# Altium schematic sheet OK1050-C_V1.2_Usb.SchDoc
size A3; Revision: 1.2; SheetNumber: 2; SheetTotal: 7
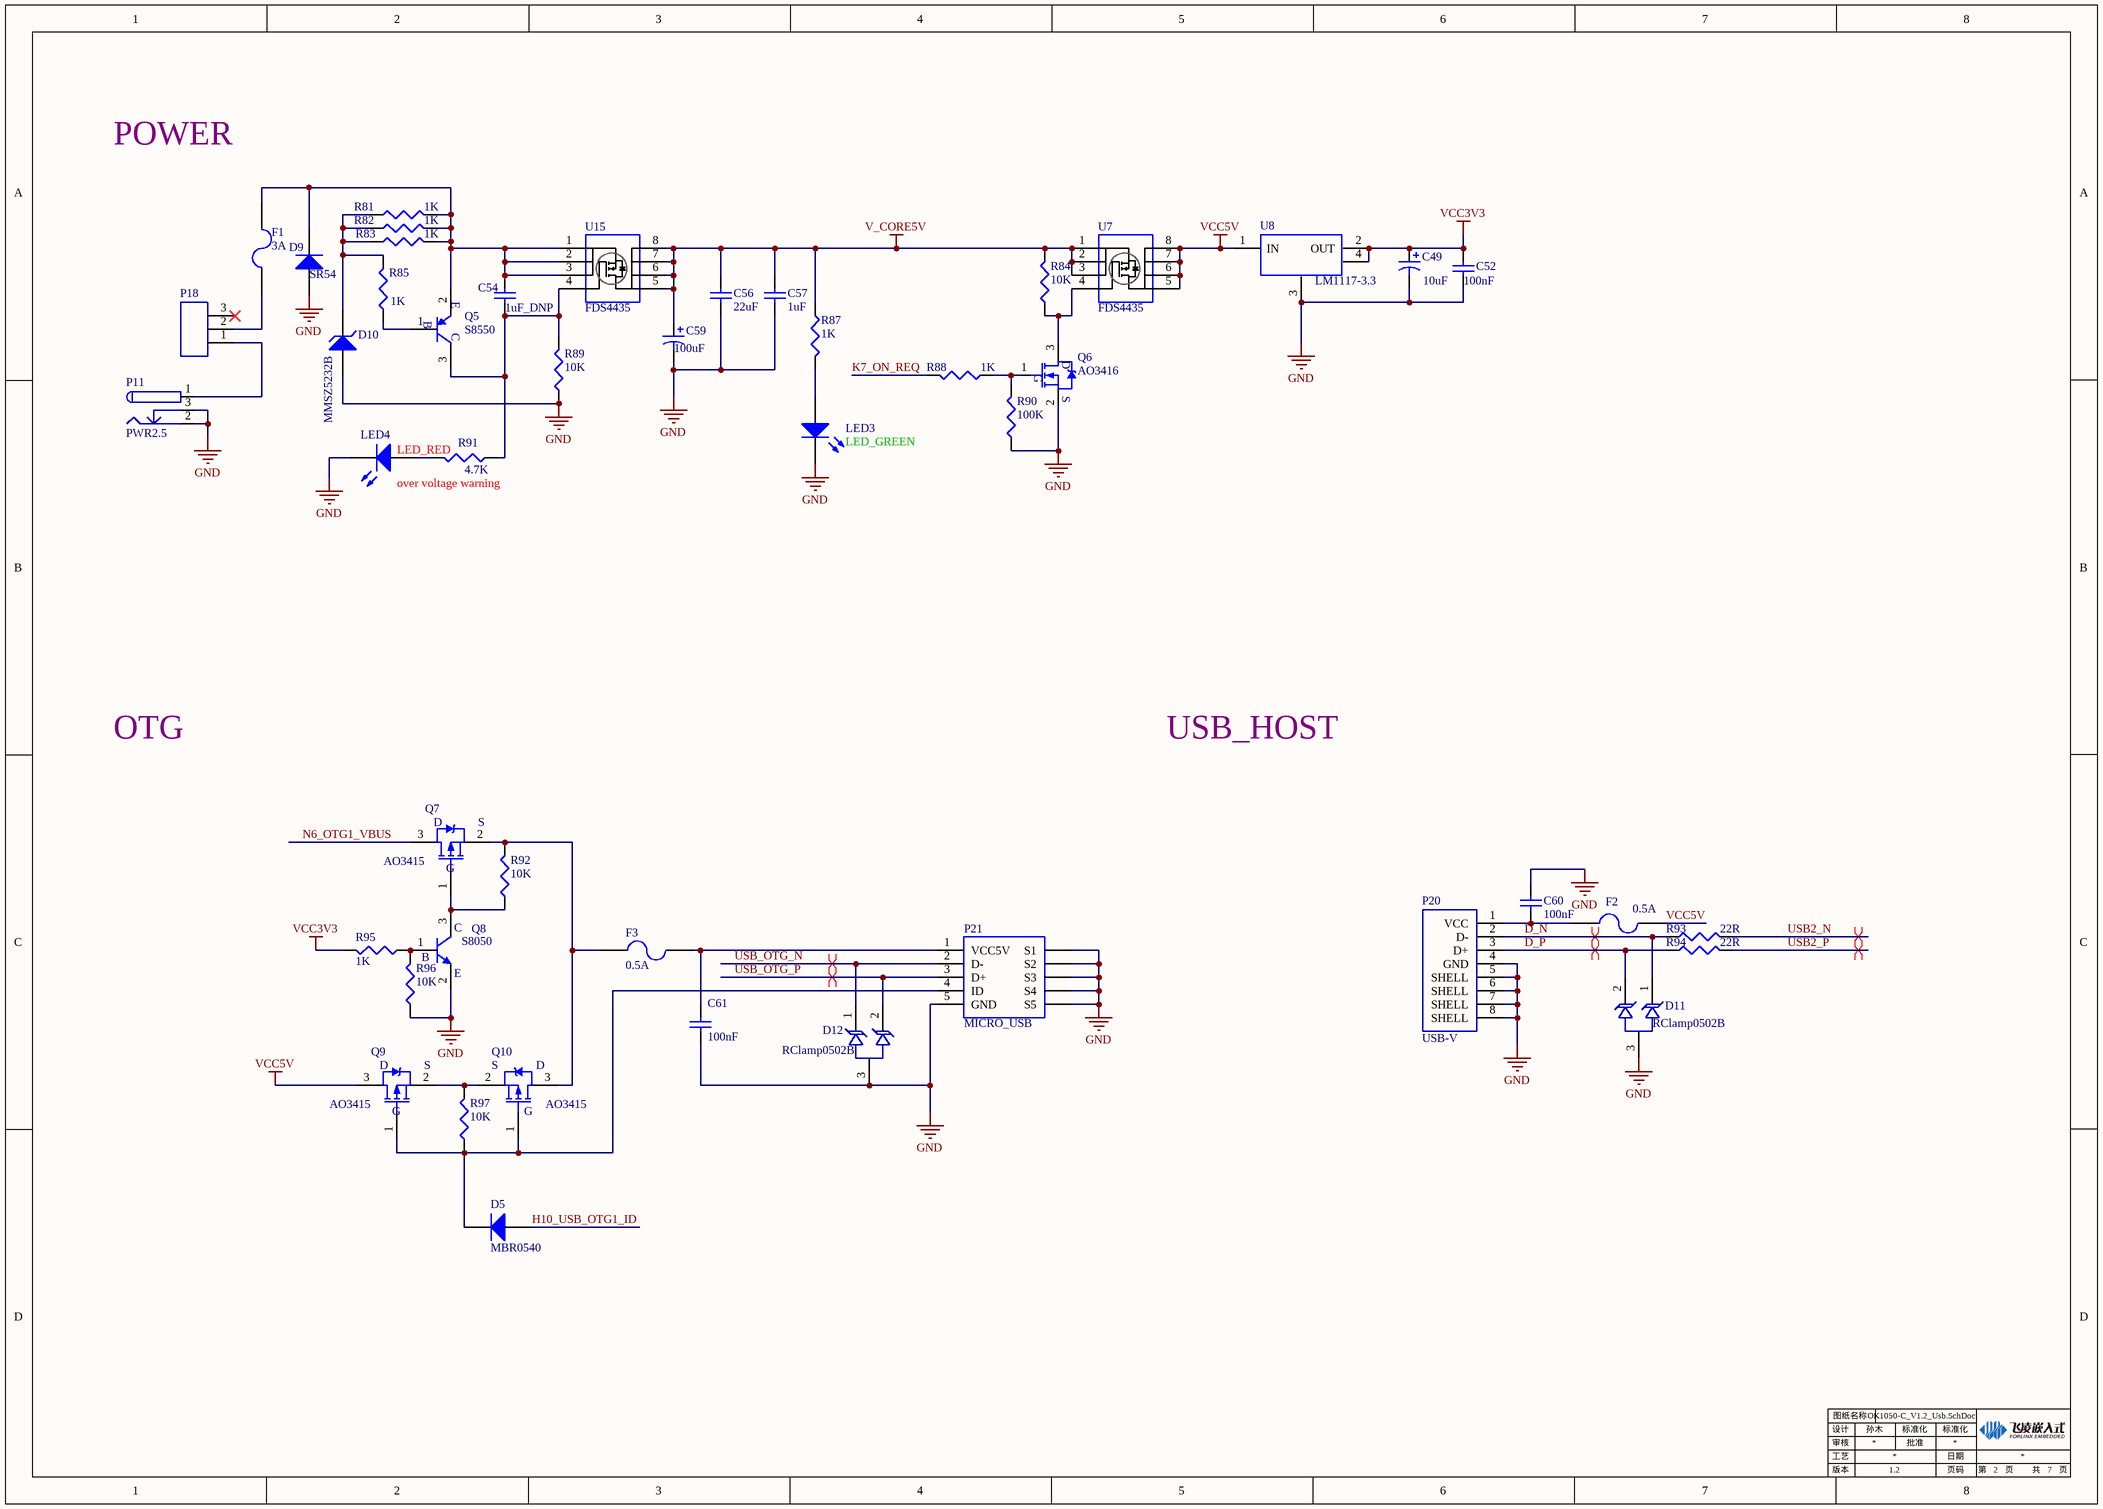
[diagram p0: OK1050-C_V1.2_Usb.SchDoc]

## Parts
C49  10uF  [TC3216A]
C52  100nF  [0603C+]
C54  1uF_DNP  [0603C+]
C56  22uF  [0603C+]
C57  1uF  [0603C+]
C59  100uF  [TC3528B]
C60  100nF  [0603C+]
C61  100nF  [0603C+]
D5  MBR0540  [Diode1.6*2.6]
D9  SR54  [SMB/DO-214AA]
D10  MMSZ5232B  [Diode1.6*2.6]
D11  RClamp0502B  [SOT-523]
D12  RClamp0502B  [SOT-523]
F1  3A  [R_1210]
F2  0.5A  [R_1210]
F3  0.5A  [R_1210]
LED3  LED_GREEN  [LED0603_M1608]
LED4  LED_RED  [LED0603_M1608]
P11  PWR2.5  [JACK-2.5MM_B]
P18  P18  [SW01]  (value not drawn)
P20  USB-V  [USB-C]
P21  MICRO_USB  [microUSB]
Q5  S8550  [SOT95P245X110-3N]
Q6  AO3416  [SOT95P245X110-3N]
Q7  AO3415  [SOT95P245X110-3N]
Q8  S8050  [SOT95P245X110-3N]
Q9  AO3415  [SOT95P245X110-3N]
Q10  AO3415  [SOT95P245X110-3N]
R81  1K  [0603R+]
R82  1K  [0603R+]
R83  1K  [0603R+]
R84  10K  [0603R+]
R85  1K  [0603R+]
R87  1K  [0603R+]
R88  1K  [0603R+]
R89  10K  [0603R+]
R90  100K  [0603R+]
R91  4.7K  [0603R+]
R92  10K  [0603R+]
R93  22R  [0603R+]
R94  22R  [0603R+]
R95  1K  [0603R+]
R96  10K  [0603R+]
R97  10K  [0603R+]
U7  FDS4435  [FDS4435]
U8  LM1117-3.3  [LM1117]
U15  FDS4435  [FDS4435]

## Nets
GND: C49.2 C52.1 C56.2 C57.2 C59.2 C60.1 C61.1 D9.1(A) D10.1(A) D11.3 D12.3 LED3.2(K) LED4.2(K) P11.2(ADJ) P11.3(ADJ) P20.4(GND) P20.5(SHELL) P20.6(SHELL) P20.7(SHELL) P20.8(SHELL) P21.5(GND) P21.6(S1) P21.7(S2) P21.8(S3) P21.9(S4) P21.10(S5) Q6.2(S) Q8.2(E) R89.1 R90.1 R96.1 U8.3(GND)
V_CORE5V: C56.1 C57.1 C59.1 R84.2 R87.1 U7.1(S) U7.2(S) U7.3(S) U15.5(D) U15.6(D) U15.7(D) U15.8(D)
VCC3V3: C49.1 C52.2 R95.2 U8.2(OUT) U8.4
VCC5V: F2.1 Q9.3(D) U7.5(D) U7.6(D) U7.7(D) U7.8(D) U8.1(IN)
D_N: D11.1 P20.2(D-) R93.1
D_P: D11.2 P20.3(D+) R94.1
H10_USB_OTG1_ID: D5.1(A)
K7_ON_REQ: R88.2
N6_OTG1_VBUS: Q7.3(D)
USB2_N: R93.2
USB2_P: R94.2
USB_OTG_N: D12.1 P21.2(D-)
USB_OTG_P: D12.2 P21.3(D+)
NetC54_1: C54.1 D9.2(K) F1.2 Q5.2(E) R81.2 R82.2 R83.2 U15.1(S) U15.2(S) U15.3(S)
NetC54_2: C54.2 Q5.3(C) R89.2 R91.1 U15.4(G)
NetC60_2: C60.2 F2.2 P20.1(VCC)
NetC61_2: C61.2 F3.1 P21.1(VCC5V)
NetD5_2: D5.2(K) P21.4(ID) Q9.1(G) Q10.1(G) R97.1
NetD10_2: D10.2(K) R81.1 R82.1 R83.1 R85.2
NetF1_1: F1.1 P18.2(DQ17)
NetF3_2: F3.2 Q7.2(S) Q10.3(D) R92.2
NetLED3_1: LED3.1(A) R87.2
NetLED4_1: LED4.1(A) R91.2
NetP11_1: P11.1(ADJ) P18.1(DQ16)
NetQ5_1: Q5.1(B) R85.1
NetQ6_1: Q6.1(G) R88.1 R90.2
NetQ6_3: Q6.3(D) R84.1 U7.4(G)
NetQ7_1: Q7.1(G) Q8.3(C) R92.1
NetQ8_1: Q8.1(B) R95.1 R96.2
NetQ9_2: Q9.2(S) Q10.2(S) R97.2

Not connected (* = marked no-connect by the designer): P18 3(DQ18)*

## Layout directives
differential pair: D_N, D_P, USB2_N, USB2_P, USB_OTG_N, USB_OTG_P

## Notes on the sheet
- POWER
- over voltage warning
- OTG
- USB_HOST
- 设计
- 审核
- 工艺
- 图纸名称
- 孙木
- 批准
- 标准化
- 日期
- 版本
- 页码
- 第
- 页
- 共

## Library data of the parts
C49 C59 = Cap Pol1: Polarized Capacitor (Radial); Published: 8-Jun-2000; LatestRevisionDate: 17-Jul-2002; LatestRevisionNote: Re-released for DXP Platform.; PackageReference: RB7.6-15; Publisher: Altium Limited; PackageDescription: Polarized Capacitor (Radial); 2 Leads
  C49: Value: 10uF
  C59: Value: 100uF
C52 = CAP: Capacitor; Value: 100nF; Published: 8-Jun-2000; LatestRevisionDate: 17-Jul-2002; LatestRevisionNote: Re-released for DXP Platform.; PackageReference: RAD-0.3; Publisher: Altium Limited; PackageDescription: Radial Cap, Thru-Hole; 2 Leads; 0.3 in Pin Spacing
C54 C56 C57 C60 C61 = Cap: Capacitor; Published: 8-Jun-2000; LatestRevisionDate: 17-Jul-2002; LatestRevisionNote: Re-released for DXP Platform.; PackageReference: RAD-0.3; Publisher: Altium Limited; PackageDescription: Radial Cap, Thru-Hole; 2 Leads; 0.3 in Pin Spacing
  C54: Value: 1uF_DNP
  C56: Value: 22uF
  C57: Value: 1uF
  C60 C61: Value: 100nF
D5 D9 = Diode: Default Diode; Published: 8-Jun-2000; LatestRevisionDate: 17-Jul-2002; LatestRevisionNote: Re-released for DXP Platform.; PackageVersion: Sep-1996; PackageReference: SMC; Publisher: Altium Limited; PackageDescription: DO-214-AB/SMC; 2 C-Bend Leads; Body 7.9 x 5.9 mm, inc. leads (LxW); Code_JEDEC: DO-214-AB
D10 = D Zener: Zener Diode; Published: 8-Jun-2000; LatestRevisionDate: 17-Jul-2002; LatestRevisionNote: Re-released for DXP Platform.; PackageReference: DIODE-0.7; Publisher: Altium Limited; PackageDescription: Diode, Thru-Hole; 2 Leads; 0.7 in Pin Spacing
D11 D12 = LCTVS: Value: RClamp0502B
F1-F3 = Fuse 2: Fuse; Published: 8-Jun-2000; LatestRevisionDate: 17-Jul-2002; LatestRevisionNote: Re-released for DXP Platform.; PackageReference: PIN-W2/E2.8; Publisher: Altium Limited; PackageDescription: Thru-Hole; 2 Leads
  F1: Value: 3A
  F2 F3: Value: 0.5A
LED3 LED4 = LED2: Typical RED, GREEN, YELLOW, AMBER GaAs LED; Published: 8-Jun-2000; LatestRevisionDate: 17-Jul-2002; LatestRevisionNote: Re-released for DXP Platform.; PackageVersion: Feb-2002; PackageReference: 3.2X1.6X1.1; Publisher: Altium Limited; PackageDescription: SM LED; 2 Flat Leads; Value: RED
P18 = CON3
P21 = MICRO_USB: Header, 5-Pin, Dual row; LatestRevisionDate: 17-Jul-2002; LatestRevisionNote: Re-released for DXP Platform.; Publisher: Altium Limited; VALUE: MICRO_USB
Q5 = PNP: NPN Bipolar Transistor; Published: 8-Jun-2000; LatestRevisionDate: 17-Jul-2002; LatestRevisionNote: Re-released for DXP Platform.; PackageReference: TO-226-AA; Publisher: Altium Limited; PackageDescription: TO, Flat Index; 3 In-Line, Axial Leads; Body Dia. 4.8mm; Leads 0.55 x 0.51 mm (max); Code_JEDEC: TO-226-AA; VALUE: S8550
Q6 = NMOS: N-Channel Power MOSFET; Note: Pin 2 is electrically connected to pin 4.; Published: 8-Jun-2000; LatestRevisionDate: 17-Jul-2002; LatestRevisionNote: Re-released for DXP Platform.; DatasheetVersion: PD-9.814; PackageVersion: Feb-1997; PackageReference: TO-220AB; Publisher: Altium Limited; PackageDescription: TO, Thru-Hole, Vertical, Heatsink Mounted; 3 In-Line Leads; Pitch 2.54 mm; ComponentLink1Description: Manufacturer Link; ComponentLink1URL: http://www.irf.com/; VALUE: AO3416
Q7 Q9 Q10 = PMOS: N-Channel Power MOSFET; Note: Pin 2 is electrically connected to pin 4.; Published: 8-Jun-2000; LatestRevisionDate: 17-Jul-2002; LatestRevisionNote: Re-released for DXP Platform.; DatasheetVersion: PD-9.814; PackageVersion: Feb-1997; PackageReference: TO-220AB; Publisher: Altium Limited; PackageDescription: TO, Thru-Hole, Vertical, Heatsink Mounted; 3 In-Line Leads; Pitch 2.54 mm; ComponentLink1Description: Manufacturer Link; ComponentLink1URL: http://www.irf.com/; VALUE: AO3415
Q8 = NPN: NPN Bipolar Transistor; Published: 8-Jun-2000; LatestRevisionDate: 17-Jul-2002; LatestRevisionNote: Re-released for DXP Platform.; PackageReference: TO-226-AA; Publisher: Altium Limited; PackageDescription: TO, Flat Index; 3 In-Line, Axial Leads; Body Dia. 4.8mm; Leads 0.55 x 0.51 mm (max); Code_JEDEC: TO-226-AA; VALUE: S8050
R81-R85 R87-R97 = Res3: Resistor; Published: 8-Jun-2000; LatestRevisionDate: 29-May-2009; LatestRevisionNote: IPC-7351 Footprint Added.; PackageReference: J1-0603; Publisher: Altium Limited; PackageDescription: Chip Resistor
  R81-R83 R85 R87 R88 R95: Value: 1K
  R84 R89 R92 R96 R97: Value: 10K
  R90: Value: 100K
  R91: Value: 4.7K
  R93 R94: Value: 22R
U8 = LM1117: Value: LM1117-3.3